# EAGLE design CKT-9000 (EAGLE 9.5.2)
DWG_NUMBER: CKT-9000; REV: B; TITLE: PIMTECTOR USB MANIFOLD
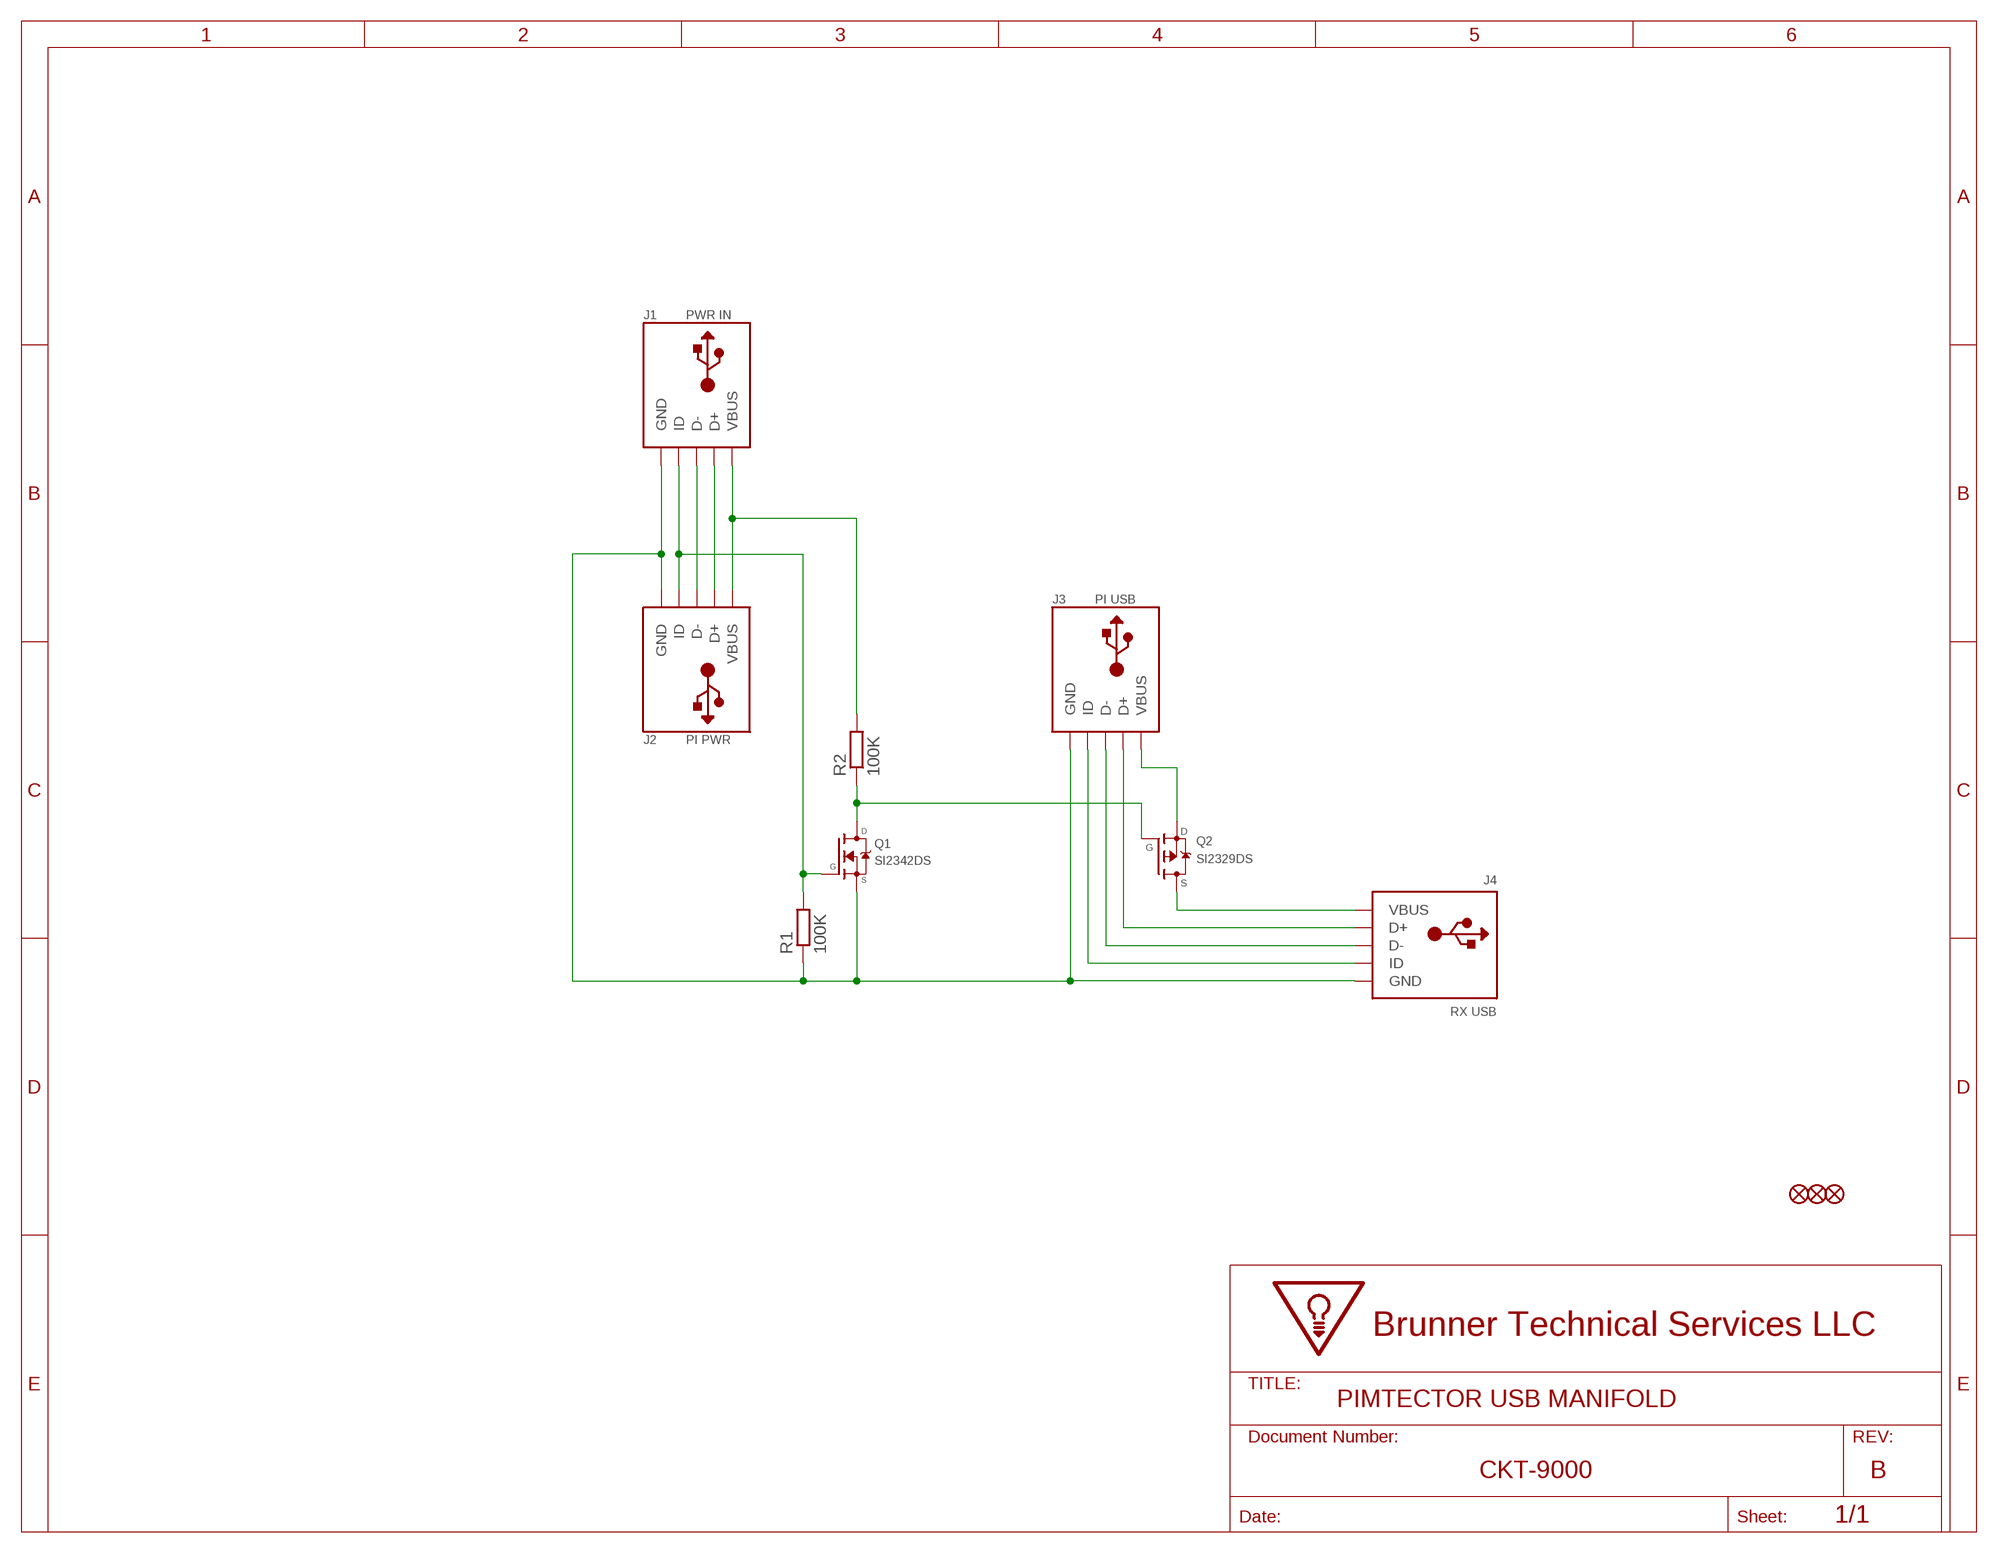
[diagram p0: schematic, sheet 1]

## Parts
FID1  FIDUCIAL""  [FIDUCIAL_1MM]
FID2  FIDUCIAL""  [FIDUCIAL_1MM]
FID3  FIDUCIAL""  [FIDUCIAL_1MM]
J1  PWR IN  USBMICROB  [GCT_USB3150]
J2  PI PWR  USBMICROB  [GCT_USB3150]
J3  PI USB  USBMICROB  [GCT_USB3150]
J4  RX USB  USB  [AMPHENOL_10103594]
Q1  SI2342DS  MOSFET-NREFLOW  [SOT23]
Q2  SI2329DS  MOSFET-PSOT23  [SOT23]
R1  100K  R-EU_R0805  [R0805]
R2  100K  R-EU_R0805  [R0805]

## Nets
D+$1: J1.D+ J2.D+
D+$2: J3.D+ J4.D+
D-$1: J1.D- J2.D-
D-$2: J3.D- J4.D-
GND: J1.GND J1.GND$1(GND) J1.GND$2(GND) J1.GND$3(GND) J1.GND$4(GND) J1.GND$5(GND) J1.GND$6(GND) J2.GND J2.GND$1(GND) J2.GND$2(GND) J2.GND$3(GND) J2.GND$4(GND) J2.GND$5(GND) J2.GND$6(GND) J3.GND J3.GND$1(GND) J3.GND$2(GND) J3.GND$3(GND) J3.GND$4(GND) J3.GND$5(GND) J3.GND$6(GND) J4.BASE@1(GND) J4.BASE@2(GND) J4.GND J4.SPRT@1(GND) J4.SPRT@2(GND) J4.SPRT@3(GND) J4.SPRT@4(GND) Q1.2(S) R1.1
ID$2: J3.ID J4.ID
N$1: Q1.3(D) Q2.1(G) R2.1
N$2: J3.VBUS Q2.2(S)
N$3: J1.ID J2.ID Q1.1(G) R1.2
N$4: J4.VBUS Q2.3(D)
VBUS$1: J1.VBUS J2.VBUS R2.2

## Library data of the parts
FID1-FID3 = brunnertech:FIDUCIAL: Fiducial Alignment Points Various fiducial points for machine vision alignment.; BOM: EXCLUDE
J1-J4 = brunnertech:USB: USB Connectors USBMINIB - Surface Mount Female Mini-B USB Connector 4UConnector: 06564
Q1 = brunnertech:MOSFET-N: N-Channel Mosfet 2N7002E - 60V 260mA SOT23 [Digikey: 2N7002ET1GOSTR-ND] - REEL BSH103 - 30V 850mA SOT23 [Digikey: 568-5013-1-ND]
Q2 = brunnertech:MOSFET-P
R1 R2 = brunnertech:R-EU_: RESISTOR, European symbol; SPICEPREFIX: R

## Board
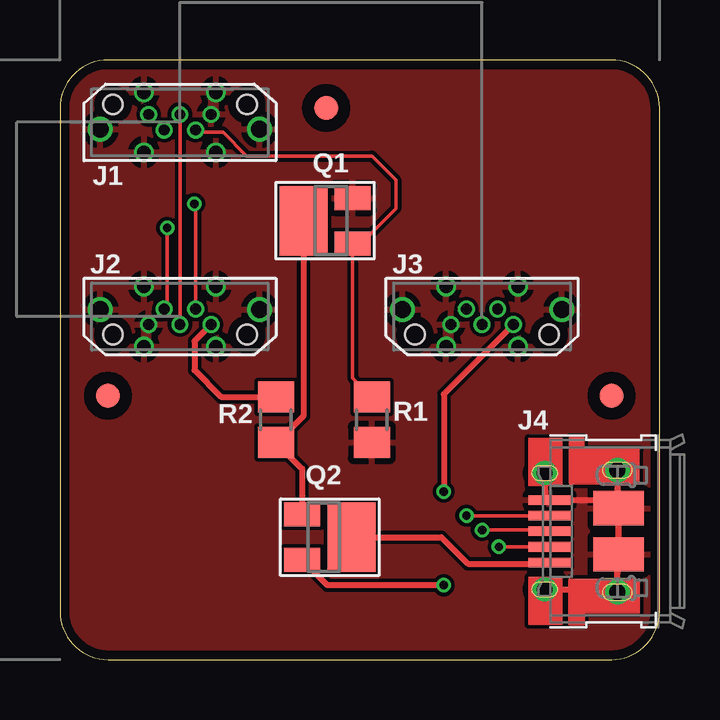
[diagram p1: board, top side]
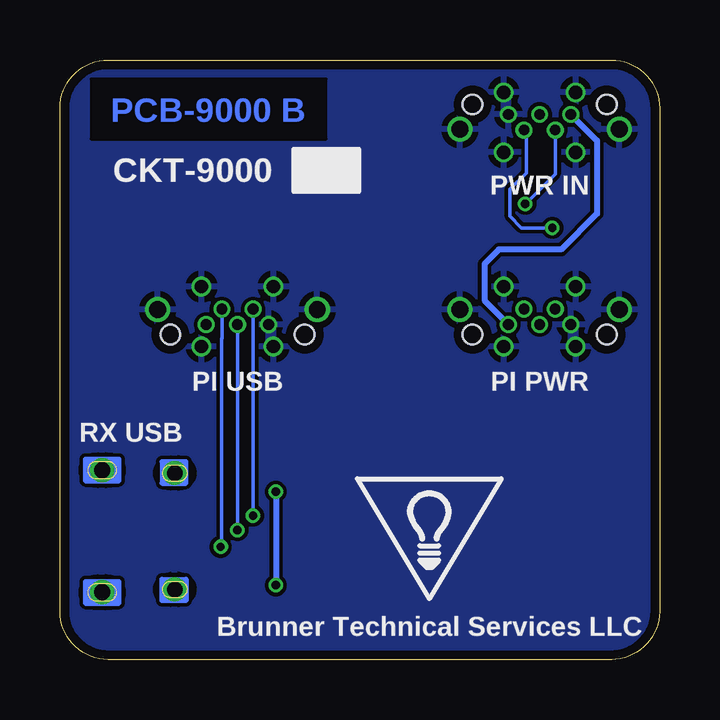
[diagram p2: board, bottom side, seen from below]

Size 25 x 25 mm. Coordinates in mm from the lower left corner, seen from the top.
Outline: 2,0 23,0 arc90 25,2 25,23 arc90 23,25 2,25 arc90 0,23 0,2 arc90 2,0
Copper layers (1*16): Top 0.035559375mm / dielectric 1.6mm / Bottom 0.035559375mm
Design rules "oshpark-2layer": minimum track width 6mil, minimum drill 10mil, track to track 6mil, track to pad 6mil, pad to pad 6mil, via to via 6mil, smd to smd 6mil, copper to edge 15mil, drill to drill 6mil, minimum pad ring 5mil, minimum via ring 5mil, stop-mask expansion 2.5mil, vias tented up to drill 0mil, thermal gap 10mil

### Footprints (pad centres in the part's own frame; a part is rotated, then mirrored left to right if it is on the bottom)
FIDUCIAL_1MM = smd 1 x 1: 1 0,0
GCT_USB3150 = drill 0.45 pad 0.61: D+ 0,0.33; D- -0.65,-0.32; GND 1.3,0.33; ID 0.65,-0.32; VBUS -1.3,0.33 | drill 0.55 pad 0.813: GND$1 -1.5,-1.25; GND$2 -1.5,1.25; GND$3 1.5,-1.25; GND$4 1.5,1.25 | drill 0.7 pad 1.016: GND$5 -3.325,-0.29; GND$6 3.325,-0.29 | hole 0.8: -2.8,0.75; 2.8,0.75
AMPHENOL_10103594 = smd 1.425 x 2.1: BASE@1 -0.963,-0.05; BASE@2 0.963,-0.05 | smd 0.4 x 1.75: D+ 0,2.825; D- -0.65,2.825; GND 1.3,2.825; ID 0.65,2.825; VBUS -1.3,2.825 | drill 0.65 pad 1: SPRT@1 -2.425,3.03; SPRT@2 2.425,3.03 | drill 0.68 pad 1: SPRT@3 -2.54,0; SPRT@4 2.54,0
SOT23 = smd 1 x 1.5: 1 -0.95,-0.9; 2 0.95,-0.9 | smd 2.9 x 2: 3 0,1.15
R0805 = smd 1.3 x 1.5: 1 -0.95,0; 2 0.95,0

### Placement (x,y rotation side)
FID1  23,11 0 top
FID2  2,11 0 top
FID3  11.1,23 0 top
J1  5,22.4 0 top
J2  5,14.3 180 top
J3  17.6,14.3 180 top
J4  23.24,5.35 90 top
Q1  11.3,18.3 90 top
Q2  11,5.1 270 top
R1  13,10 90 top
R2  9,10 90 top
U$1  [BTS_SILK_LOGO]  9.6,2.5 0 bottom

### Tracks (layer width: path | path; a pad name or v marks a point on that pad's centre or on a via)
D+$1
  Top 0.152: J1.D+ J2.D+
D+$2  (via drill 0.35)
  Top 0.152: J4.D+ 20.36,5.4 v17.6,5.4
  Bottom 0.152: J3.D+ v17.6,5.4
D-$1  (via drill 0.35)
  Top 0.152: v5.6,19 5.65,18.95 J2.D-
  Bottom 0.152: J1.D- 4.35,20.25 v5.6,19
D-$2  (via drill 0.35)
  Top 0.152: J4.D- v18.3,4.7
  Bottom 0.152: v18.3,4.7 18.25,4.75 18.25,13.38 J3.D-
GND
  Top 0.254: J4.SPRT@4 23.24,6.36 | 23.24,6.36 J4.BASE@2 J4.BASE@1 23.24,4.34 23.24,3 | J4.SPRT@3 23.24,3 | 23.24,6.36 22.95,6.65 J4.GND 20.21,6.86 J4.SPRT@2 | J4.SPRT@1 23.16,2.92 23.24,3
  pour Top: 0,2 0,23 arc-90 2,25 23,25 arc-90 25,23 25,2 arc-90 23,0 2,0 arc-90
  pour Bottom: 0,2 0,23 arc-90 2,25 23,25 arc-90 25,23 25,2 arc-90 23,0 2,0 arc-90
  cutout Bottom: 23.7,21.7 13.9,21.7 13.9,24.2 23.7,24.2
ID$2  (via drill 0.35)
  Top 0.152: v16.95,6 J4.ID
  Bottom 0.152: J3.ID v16.95,6
N$1
  Top 0.254: Q1.3 10.15,10.15 9.03,9.03 R2.1 10.1,7.95 Q2.1
N$2  (via drill 0.35)
  Top 0.254: J3.VBUS 16,11.07 v16,7 | v16,3.1 11.15,3.1 Q2.2
  Bottom 0.254: v16,7 v16,3.1
N$3  (via drill 0.35)
  Top 0.152: J1.ID 5.74,21.99 6.8,21.99 7.79,21 13,21 14,20 14,18.8 12.2,17 12.2,11.75 R1.2 | J2.ID 4.47,14.74 v4.47,18
  Top 0.254: Q1.1 12.2,17
  Bottom 0.152: v4.47,18 5.75,18 6.23,18.48 6.23,19.61 5.56,20.28 5.56,21.99 J1.ID
N$4
  Top 0.254: Q2.3 15.9,5.1 17,4 20.36,4 J4.VBUS
VBUS$1
  Top 0.254: J2.VBUS 5.61,13.28 5.61,12.06 6.72,10.95 R2.2
  Bottom 0.254: J1.VBUS 2.61,21.64 2.61,18.59 4.1,17.1 6.7,17.1 7.3,16.5 7.3,14.97 J2.VBUS

### Text on the board
Bottom: PCB-9000 B
bPlace: CKT-9000 | Brunner Technical Services LLC